# Altium schematic sheet 06_ZYNQ_PS.SchDoc
size A3; SheetNumber: 6; SheetTotal: 10
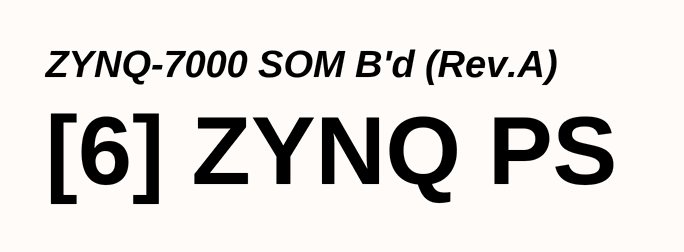
[diagram p0: 06_ZYNQ_PS.SchDoc]

## Notes on the sheet
- ZYNQ-7000 SOM B'd (Rev.A)
- [6] ZYNQ PS
- Title
- Rev
- Doc
- Sheet #
- of
- Author
- This document is copyright of ArkX and shall not be revealed, produced, copied, in whole or in part,
- Date
- nor used for any purpose other than submitted.